# Altium schematic sheet ConnectorSch.SchDoc
size A
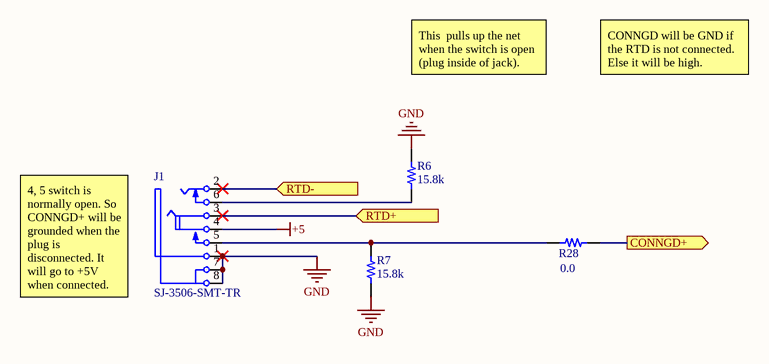
[diagram p0: ConnectorSch.SchDoc]

## Parts
J1  SJ-3506-SMT-TR  [CUI-SJ-3506-SMT-TR_V]
R6  15.8k  [RES 0805/2012]
R7  15.8k  [RES 0805/2012]
R28  0.0  [RES 1206/3216]

## Ports
CONNGD+ (out), RTD+ (in), RTD- (in)

## Nets
+5: J1.4(IR)
GND: J1.1(S) J1.7(SHLD1) J1.8(SHLD2) R6.1 R7.1
CONNGD+: R28.2 ; port CONNGD+
RTD+: J1.3(R) ; port RTD+
RTD-: J1.2(T) ; port RTD-
NetJ1_5: J1.5(RN) R7.2 R28.1
NetJ1_6: J1.6(TN) R6.2

## Notes on the sheet
- This  pulls up the net when the switch is open (plug inside of jack).
- CONNGD will be GND if the RTD is not connected. Else it will be high.
- 4, 5 switch is normally open. So CONNGD+ will be grounded when the plug is disconnected. It will go to +5V when connected.

## Library data of the parts
J1 = CMP-1692-00003-1: Female Mid Mount Audio Jack, 6 Position, Height 2.55 mm, Tail Length 2 mm, -25 to 85 degC, RoHS, Tape and Reel; Current Rating: 7 A; Impedance: 50 Ohm; ComponentLink2URL: http://www.cui.com/product/resource/sj-3506-smt.pdf; DatasheetVersion: Rev. 1.01, 11/2012; Length: 5 mm; Radiation Hardening: No; ComponentLink1URL: http://www.cui.com/; ComponentLink2Description: Datasheet; PackageReference: SJ-3506-SMT-TR; Package Quantity: 500; Min Operating Temperature: -40degC; RoHSCompliant: True; Width: 3.6 mm; REACH SVHC: No SVHC; Mount: Through Hole; Diameter: 3.6 mm; ComponentLink1Description: Manufacturer URL; Max Operating Temperature: 85degC; Pins: 2; Case/Package: Axial; Height: 3.6 mm; PackageDescription: Female Mid Mount Audio Jack, 6 Position, Height 2.55 mm, Tail Length 2 mm; Packaging: Bulk
R6 R7 = ERJ-6ENF1582V: RES SMD 15.8K OHM 1% 1/8W 0805; Manufacturer: Panasonic Electronic Components; TemperatureRange: -55C ~ 155C; TemperatureCoefficient: 100ppm/C; PowerRating: 0.125W, 1/8W; Value: 15.8k; Part Number: ERJ-6ENF1582V; PartId: 2101; Supplier 1: Digi-Key; Supplier Part Number 1: P15.8KCTR-ND; ComponentLink1Description: Datasheet; ComponentLink1URL: http://industrial.panasonic.com/www-cgi/jvcr13pz.cgi?E+PZ+3+AOA0002+ERJ6ENF1582V+7+WW; ComponentLink2Description: Digi-Key listing; ComponentLink2URL: http://digikey.com/product-detail/en/ERJ-6ENF1582V/P15.8KCTR-ND/6419; Tolerance: 1%; Price: 0.0073; Type: Thick Film; Device Package: 0805 (2012 Metric)
R28 = ERJ-8GEY0R00V: RES SMD 0.0 OHM JUMPER 1/4W 1206; Manufacturer: Panasonic Electronic Components; TemperatureRange: -55C ~ 155C; PowerRating: 0.25W, 1/4W; Value: 0.0; Part Number: ERJ-8GEY0R00V; PartId: 16165; Supplier 1: Digi-Key; Supplier Part Number 1: P0.0ETR-ND; ComponentLink1Description: Datasheet; ComponentLink1URL: http://industrial.panasonic.com/www-cgi/jvcr13pz.cgi?E+PZ+3+AOA0001+ERJ8GEY0R00V+7+WW; ComponentLink2Description: Digi-Key Listing; ComponentLink2URL: https://www.digikey.com/product-detail/en/panasonic-electronic-components/ERJ-8GEY0R00V/P0.0ETR-ND/27495; Tolerance: Jumper; Price: 0.0067; Device Package: 1206 (3216 Metric)